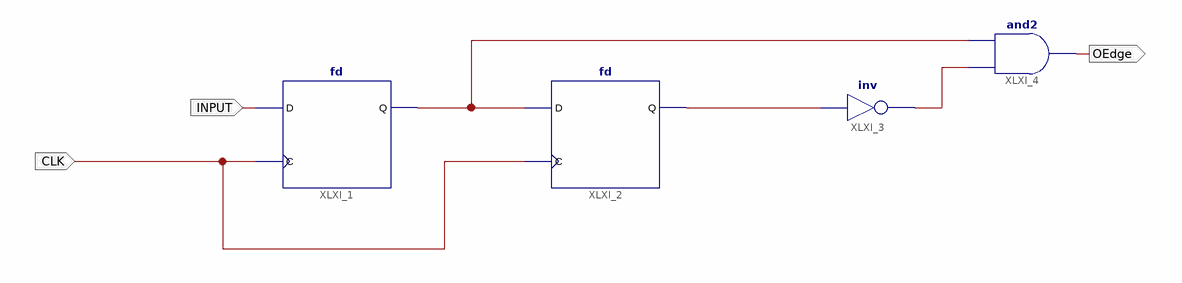
[diagram p0: schematic sheet 1]
// Xilinx ISE schematic Egde_detector.sch (spartan6) as structural Verilog: 4 symbols, 3 ports
module Egde_detector (
  input  CLK,
  input  INPUT,
  output OEdge
);

  wire XLXN_2, XLXN_3, XLXN_4;

  fd XLXI_1 (.C(CLK), .D(INPUT), .Q(XLXN_4));
  fd XLXI_2 (.C(CLK), .D(XLXN_4), .Q(XLXN_2));
  not XLXI_3 (XLXN_3, XLXN_2);
  and XLXI_4 (OEdge, XLXN_3, XLXN_4);
endmodule
